# EasyEDA schematic driver_f103_立创EDA.json
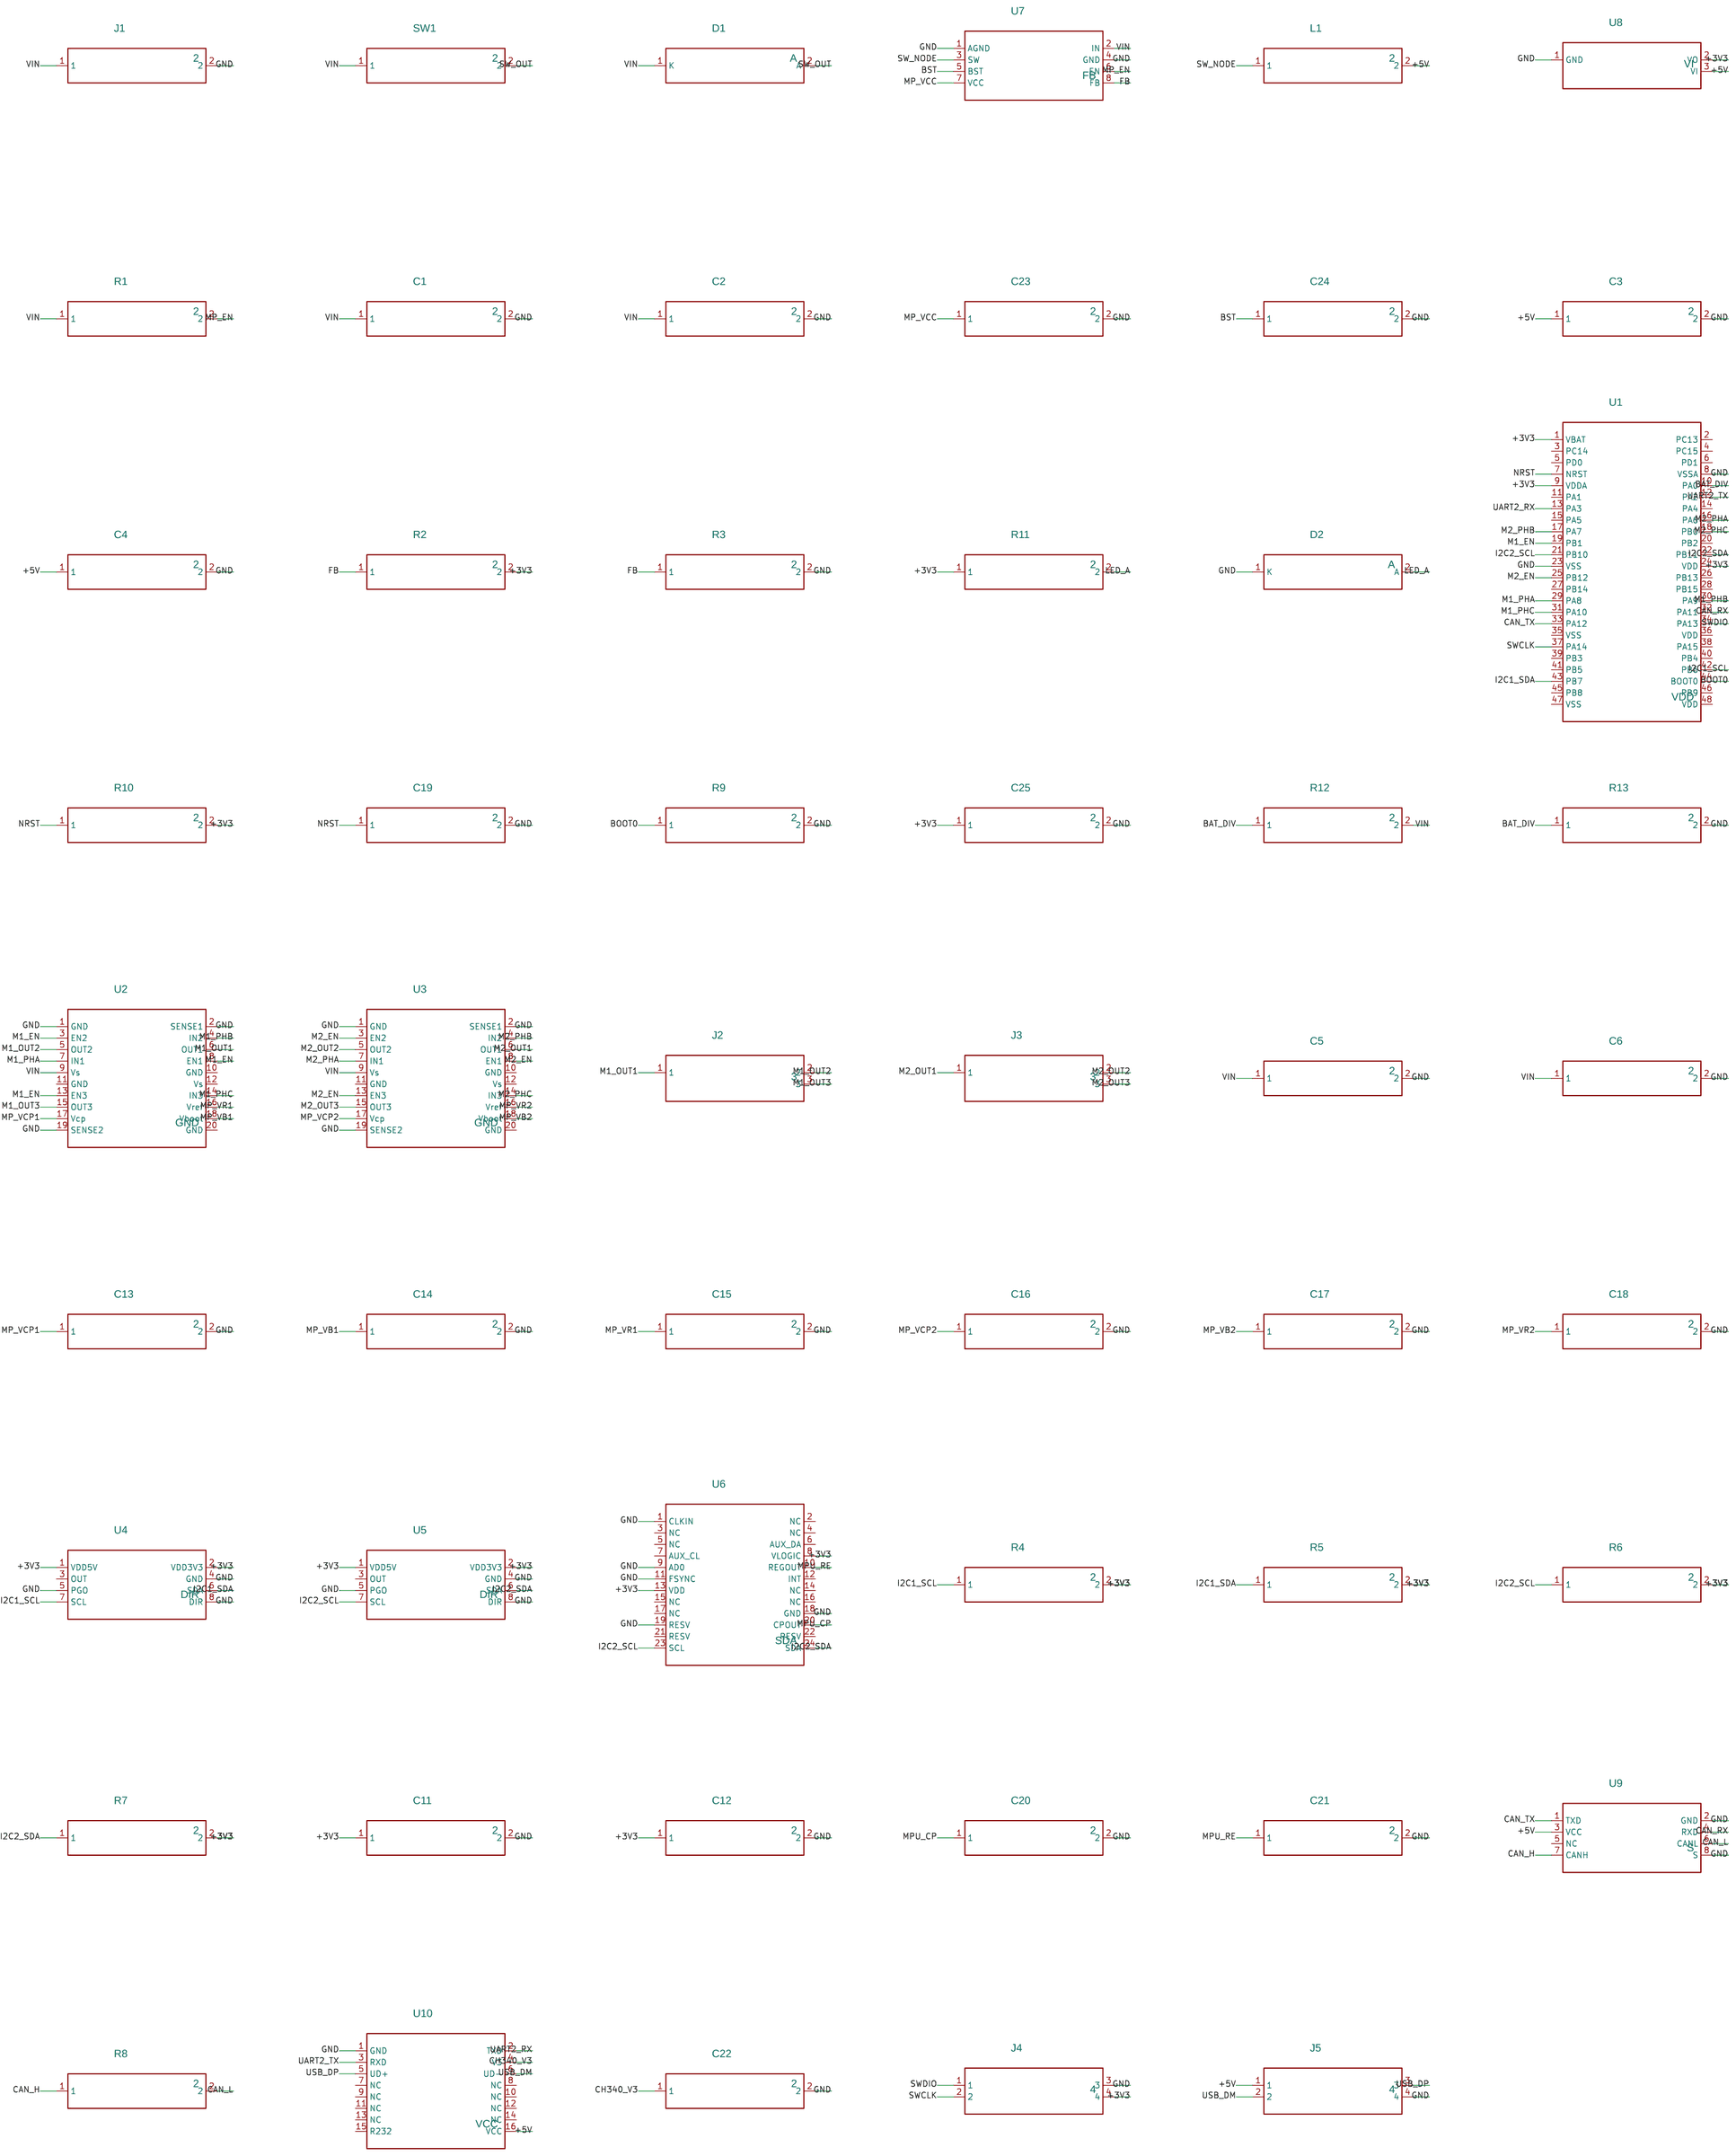
[diagram p0: schematic sheet]

## Parts
C1  22uF  [C0805]
C2  0.1uF  [C0805]
C3  22uF  [C0805]
C4  0.1uF  [C0805]
C5  100uF  [C0805]
C6  100nF  [C0805]
C11  100nF  [C0805]
C12  100nF  [C0805]
C13  220nF  [C0805]
C14  1uF  [C0805]
C15  10nF  [C0805]
C16  220nF  [C0805]
C17  1uF  [C0805]
C18  10nF  [C0805]
C19  100nF  [C0805]
C20  2.2uF  [C0805]
C21  0.1uF  [C0805]
C22  10nF  [C0805]
C23  1uF  [C0805]
C24  0.1uF  [C0805]
C25  100nF  [C0805]
D1  SS34  [SOD-123_L2.8-W1.8-LS3.7-RD]
D2  RED  [LED0805_RED]
J1  BAT  [HDR-M-2.54_1X2]
J2  M1  [HDR-M-2.54_1X3]
J3  M2  [HDR-M-2.54_1X3]
J4  SWD  [HDR-M-2.54_1X4]
J5  USB  [HDR-M-2.54_1X4]
L1  4.7uH  [IND-SMD_L7.3-W6.6]
R1  100k  [R0805]
R2  40.2k  [R0805]
R3  5.49k  [R0805]
R4  4.7k  [R0805]
R5  4.7k  [R0805]
R6  4.7k  [R0805]
R7  4.7k  [R0805]
R8  120  [R0805]
R9  10k  [R0805]
R10  10k  [R0805]
R11  1k  [R0805]
R12  100k  [R0805]
R13  100k  [R0805]
SW1  SW  [SW-TH_SS-12D02-VG4]
U1  STM32F103C8T6  [LQFP-48_L7.0-W7.0-P0.50-LS9.0-BL]
U2  L6234  [POWERSO20_L15.9-W11.0-P1.27-LS14.2-BL-EP]
U3  L6234  [POWERSO20_L15.9-W11.0-P1.27-LS14.2-BL-EP]
U4  AS5600  [SOIC-8_L5.0-W4.0-P1.27-LS6.0-BL]
U5  AS5600  [SOIC-8_L5.0-W4.0-P1.27-LS6.0-BL]
U6  MPU6050  [QFN-24_L4.0-W4.0-P0.50-BL-EP]
U7  MP2225  [TSOT-23-8_L2.9-W1.6-P0.65-LS2.8-BR]
U8  AMS1117-3.3  [SOT-223_L6.7-W3.5-P2.30-BR]
U9  TJA1051T  [SOIC-8_L5.0-W4.0-P1.27-LS6.0-BL]
U10  CH340C  [SOP-16_L10.0-W3.9-P1.27-LS6.0-BL]

## Library data of the parts
C1-C6 C11-C25 D1 D2 J1-J5 L1 R1-R13 SW1 U1-U10 = -: : Contributor; LCEDA_Lib: spicePre; U: spiceSymbolName

## Nets
+3V3: C11.1 C12.1 C25.1 J4.4 R2.2 R4.2 R5.2 R6.2 R7.2 R10.2 R11.1 U1.1(VBAT) U1.9(VDDA) U1.24(VDD) U4.1(VDD5V) U4.2(VDD3V3) U5.1(VDD5V) U5.2(VDD3V3) U6.8(VLOGIC) U6.13(VDD) U8.2(VO)
+5V: C3.1 C4.1 J5.1 L1.2 U8.3(VI) U9.3(VCC) U10.16(VCC)
GND: C1.2 C2.2 C3.2 C4.2 C5.2 C6.2 C11.2 C12.2 C13.2 C14.2 C15.2 C16.2 C17.2 C18.2 C19.2 C20.2 C21.2 C22.2 C23.2 C24.2 C25.2 D2.1(K) J1.2 J4.3 J5.4 R3.2 R9.2 R13.2 U1.8(VSSA) U1.23(VSS) U2.1(GND) U2.2(SENSE1) U2.19(SENSE2) U3.1(GND) U3.2(SENSE1) U3.19(SENSE2) U4.4(GND) U4.5(PGO) U4.8(DIR) U5.4(GND) U5.5(PGO) U5.8(DIR) U6.1(CLKIN) U6.9(AD0) U6.11(FSYNC) U6.18(GND) U6.19(RESV) U7.1(AGND) U7.4(GND) U8.1(GND) U9.2(GND) U9.8(S) U10.1(GND)
VIN: C1.1 C2.1 C5.1 C6.1 D1.1(K) J1.1 R1.1 R12.2 SW1.1 U2.9(Vs) U3.9(Vs) U7.2(IN)
BAT_DIV: R12.1 R13.1 U1.10(PA0)
BOOT0: R9.1 U1.44(BOOT0)
BST: C24.1 U7.5(BST)
CAN_H: R8.1 U9.7(CANH)
CAN_L: R8.2 U9.6(CANL)
CAN_RX: U1.32(PA11) U9.4(RXD)
CAN_TX: U1.33(PA12) U9.1(TXD)
CH340_V3: C22.1 U10.4(V3)
FB: R2.1 R3.1 U7.8(FB)
I2C1_SCL: R4.1 U1.42(PB6) U4.7(SCL)
I2C1_SDA: R5.1 U1.43(PB7) U4.6(SDA)
I2C2_SCL: R6.1 U1.21(PB10) U5.7(SCL) U6.23(SCL)
I2C2_SDA: R7.1 U1.22(PB11) U5.6(SDA) U6.24(SDA)
LED_A: D2.2(A) R11.2
M1_EN: U1.19(PB1) U2.3(EN2) U2.8(EN1) U2.13(EN3)
M1_OUT1: J2.1 U2.6(OUT1)
M1_OUT2: J2.2 U2.5(OUT2)
M1_OUT3: J2.3 U2.15(OUT3)
M1_PHA: U1.29(PA8) U2.7(IN1)
M1_PHB: U1.30(PA9) U2.4(IN2)
M1_PHC: U1.31(PA10) U2.14(IN3)
M2_EN: U1.25(PB12) U3.3(EN2) U3.8(EN1) U3.13(EN3)
M2_OUT1: J3.1 U3.6(OUT1)
M2_OUT2: J3.2 U3.5(OUT2)
M2_OUT3: J3.3 U3.15(OUT3)
M2_PHA: U1.16(PA6) U3.7(IN1)
M2_PHB: U1.17(PA7) U3.4(IN2)
M2_PHC: U1.18(PB0) U3.14(IN3)
MP_EN: R1.2 U7.6(EN)
MP_VB1: C14.1 U2.18(Vboot)
MP_VB2: C17.1 U3.18(Vboot)
MP_VCC: C23.1 U7.7(VCC)
MP_VCP1: C13.1 U2.17(Vcp)
MP_VCP2: C16.1 U3.17(Vcp)
MP_VR1: C15.1 U2.16(Vref)
MP_VR2: C18.1 U3.16(Vref)
MPU_CP: C20.1 U6.20(CPOUT)
MPU_RE: C21.1 U6.10(REGOUT)
NRST: C19.1 R10.1 U1.7(NRST)
SW_NODE: L1.1 U7.3(SW)
SW_OUT: D1.2(A) SW1.2
SWCLK: J4.2 U1.37(PA14)
SWDIO: J4.1 U1.34(PA13)
UART2_RX: U1.13(PA3) U10.2(TXD)
UART2_TX: U1.12(PA2) U10.3(RXD)
USB_DM: J5.2 U10.6(UD-)
USB_DP: J5.3 U10.5(UD+)

Not connected (* = marked no-connect by the designer): U1 2(PC13) 3(PC14) 4(PC15) 5(PD0) 6(PD1) 11(PA1) 14(PA4) 15(PA5) 20(PB2) 26(PB13) 27(PB14) 28(PB15) 35(VSS) 36(VDD) 38(PA15) 39(PB3) 40(PB4) 41(PB5) 45(PB8) 46(PB9) 47(VSS) 48(VDD); U2 10(GND) 11(GND) 12(Vs) 20(GND); U3 10(GND) 11(GND) 12(Vs) 20(GND); U4 3(OUT); U5 3(OUT); U6 2(NC) 3(NC) 4(NC) 5(NC) 6(AUX_DA) 7(AUX_CL) 12(INT) 14(NC) 15(NC) 16(NC) 17(NC) 21(RESV) 22(RESV); U9 5(NC); U10 7(NC) 8(NC) 9(NC) 10(NC) 11(NC) 12(NC) 13(NC) 14(NC) 15(R232)
